# EAGLE design TFTBackpack (EAGLE 7.6.0)
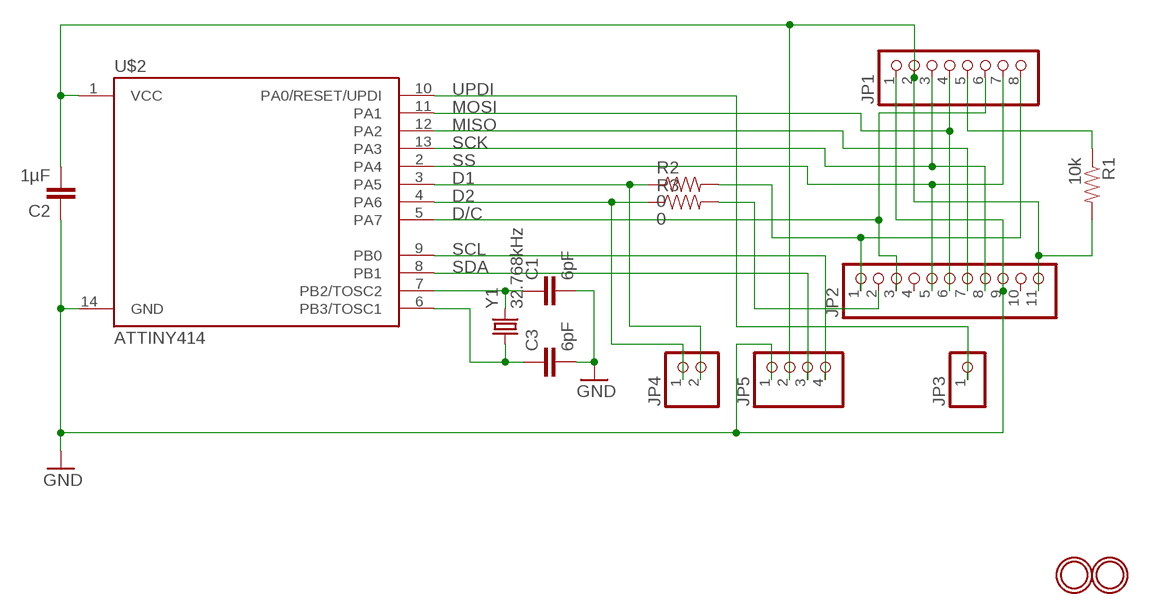
[diagram p0: schematic, sheet 1]

## Parts
C1  6pF  CAP0805  [0805]
C2  1µF  CAP0805  [0805]
C3  6pF  CAP0805  [0805]
JP1  HEADER-1X8ROUND  [1X08_ROUND]
JP2  HEADER-1X11  [1X11_ROUND]
JP3  HEADER-1X1ROUND  [1X01_ROUND]
JP4  HEADER-1X2ROUND  [1X02_ROUND]
JP5  HEADER-1X4ROUND  [1X04_ROUND]
R1  10k  0.3OHM-1/8W-1%(0805)  [0805]
R2  0  0.3OHM-1/8W-1%(0805)  [0805]
R3  0  0.3OHM-1/8W-1%(0805)  [0805]
U$1  MOUNTINGHOLE2.5  [MOUNTINGHOLE_2.5_PLATED]
U$2  ATTINY414  [SO14]
U$9  MOUNTINGHOLE2.5  [MOUNTINGHOLE_2.5_PLATED]
Y1  32.768kHz  CRYSTAL3.2X1.5MM  [CRYSTAL-SMD-3.2X1.5MM]

## Nets
BL: JP1.8 JP2.1 R2.2
D1: JP4.2 R2.1 U$2.3(PA5)
D2: JP4.1 R3.1 U$2.4(PA6)
D/C: JP1.6 JP2.3 U$2.5(PA7)
GND: C1.2 C2.1 C3.2 JP1.1 JP2.9 JP5.1 U$2.14(GND)
MISO: JP2.7 U$2.12(PA2)
MOSI: JP1.4 JP2.6 U$2.11(PA1)
N$2: C1.1 U$2.7(PB2/TOSC2) Y1.P$2
N$3: C3.1 U$2.6(PB3/TOSC1) Y1.P$1
N$4: JP1.5 R1.1
N$5: JP2.2 R3.2
SCK: JP1.3 JP2.8 U$2.13(PA3)
SCL: JP5.4 U$2.9(PB0)
SDA: JP5.3 U$2.8(PB1)
SS: JP1.7 JP2.5 U$2.2(PA4)
UPDI: JP3.1 U$2.10(PA0/RESET/UPDI)
VCC: C2.2 JP1.2 JP2.11 JP5.2 R1.2 U$2.1(VCC)
Unconnected: JP2.4 JP2.10

## Library data of the parts
C1-C3 = SparkFun-Capacitors:CAP: Capacitor Standard 0603 ceramic capacitor, and 0.1" leaded capacitor.
JP1 = technoblogy:HEADER-1X8: PIN HEADER
JP2 = technoblogy:HEADER-1X11
JP3 = microbuilder:HEADER-1X1: PIN HEADER
JP4 = microbuilder:HEADER-1X2: PIN HEADER
JP5 = microbuilder:HEADER-1X4: PIN HEADER
R1-R3 = SparkFun-Resistors:0.3OHM-1/8W-1%(0805): RES-11622; PROD_ID: RES-11622; VALUE: 0.3
U$1 U$9 = microbuilder:MOUNTINGHOLE: Mounting Hole For #2 screws (0.086"/2.18mm width, 0.094"/2.4mm hole) use 2.5mm; BOM: EXCLUDE
U$2 = technoblogy:ATTINY414: Atmel 14-pin 2/4/8kB flash uC; PROD_ID: IC-11285
Y1 = SparkFun-FreqCtrl:CRYSTAL: Various standard crystals. Proven footprints.; PROD_ID: XTAL-13062

## Net classes
1 power: width 0.305 mm

## Board
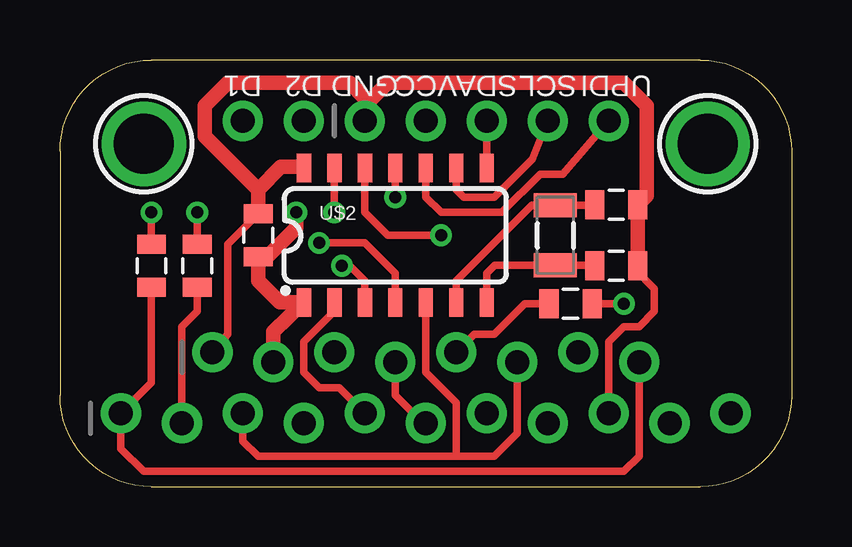
[diagram p1: board, top side]
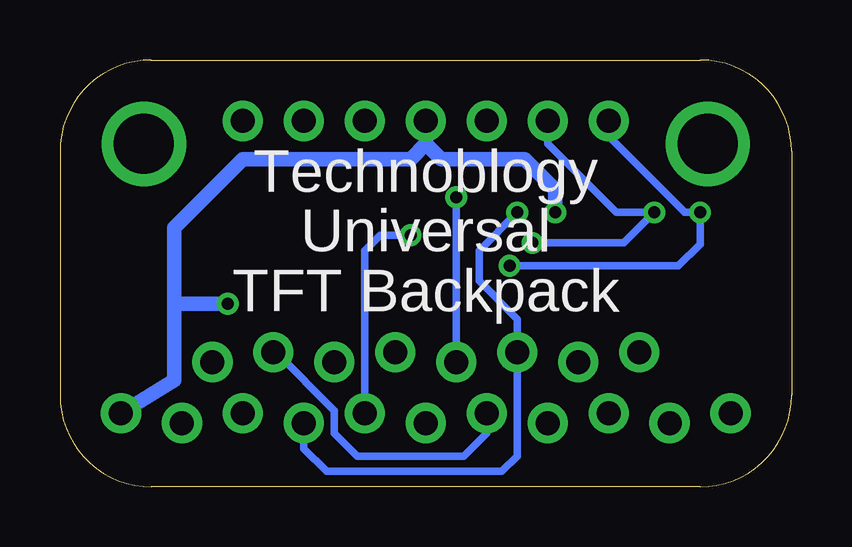
[diagram p2: board, bottom side, seen from below]

Size 30.48 x 17.78 mm. Coordinates in mm from the lower left corner, seen from the top.
Outline: 0,13.97 arc-90 3.81,17.78 26.67,17.78 arc-90 30.48,13.97 30.48,3.81 arc-90 26.67,0 3.81,0 arc-90 0,3.81 0,13.97
Copper layers (1*16): Top 0.035mm / dielectric 1.5mm / Bottom 0.035mm
Design rules "default *": minimum track width 10mil, minimum drill 24mil, track to track 8mil, track to pad 8mil, pad to pad 8mil, via to via 8mil, smd to smd 8mil, copper to edge 40mil, drill to drill 8mil, minimum pad ring 10mil, minimum via ring 8mil, stop-mask expansion 4mil, vias tented up to drill 20mil, thermal gap 10mil

### Footprints (pad centres in the part's own frame; a part is rotated, then mirrored left to right if it is on the bottom)
0805 = smd 0.8 x 1.2: 1 -0.9,0; 2 0.9,0
1X08_ROUND = drill 1 pad 1.676: 1 -8.89,0.203; 2 -6.35,-0.203; 3 -3.81,0.203; 4 -1.27,-0.203; 5 1.27,0.203; 6 3.81,-0.203; 7 6.35,0.203; 8 8.89,-0.203
1X11_ROUND = drill 1 pad 1.676: 1 -12.7,0.203; 2 -10.16,-0.203; 3 -7.62,0.203; 4 -5.08,-0.203; 5 -2.54,0.203; 6 0,-0.203; 7 2.54,0.203; 8 5.08,-0.203; 9 7.62,0.203; 10 10.16,-0.203; 11 12.7,0.203
1X01_ROUND = drill 1 pad 1.676: 1 0,0
1X02_ROUND = drill 1 pad 1.676: 1 -1.27,0; 2 1.27,0
1X04_ROUND = drill 1 pad 1.676: 1 -3.81,0; 2 -1.27,0; 3 1.27,0; 4 3.81,0
MOUNTINGHOLE_2.5_PLATED = drill 2.5 pad 3.2: P$1 0,0
SO14 = smd 0.6 x 1.2: 1 -3.81,-2.8; 2 -2.54,-2.8; 3 -1.27,-2.8; 4 0,-2.8; 5 1.27,-2.8; 6 2.54,-2.8; 7 3.81,-2.8; 8 3.81,2.8; 9 2.54,2.8; 10 1.27,2.8; 11 0,2.8; 12 -1.27,2.8; 13 -2.54,2.8; 14 -3.81,2.8
CRYSTAL-SMD-3.2X1.5MM = smd 1 x 1.8: P$1 -1.25,0; P$2 1.25,0

### Placement (x,y rotation side)
C1  23.18,9.21 0 top
C2  8.26,10.48 270 top
C3  23.18,11.75 0 top
JP1  15.24,5.4 0 top
JP2  15.24,2.86 0 top
JP3  22.86,15.24 0 top
JP4  8.89,15.24 180 top
JP5  16.51,15.24 0 top
R1  21.27,7.62 0 top
R2  3.81,9.21 270 top
R3  5.71,9.21 270 top
U$1  3.49,14.29 0 top
U$2  13.97,10.48 0 top
U$9  26.99,14.29 0 top
Y1  20.64,10.48 270 top

### Tracks (layer width: path | path; a pad name or v marks a point on that pad's centre or on a via)
BL
  Top 0.305: JP1.8 24.13,1.27 23.49,0.64 3.49,0.64 2.54,1.59 JP2.1 3.81,4.33 R2.2
D1  (via drill 0.5)
  Top 0.305: R2.1 v3.81,11.43 | v11.75,9.21 12.06,9.21 12.7,8.57 U$2.3
  Bottom 0.305: v11.75,9.21 4.71,9.21 R2.1 v3.81,11.43 4.45,11.43 7.62,14.61 JP4.2
D2  (via drill 0.5)
  Top 0.305: 13.97,7.3 U$2.4 13.97,8.89 12.7,10.16 v10.79,10.16 | v5.71,11.43 R3.1
  Bottom 0.305: v10.79,10.16 6.98,10.16 v5.71,11.43 7.3,11.43 10.16,14.29 JP4.1
D/C
  Top 0.305: 16.51,1.27 18.1,1.27 19.05,2.22 JP1.6 19.05,5.4 | 16.51,1.27 8.26,1.27 7.62,1.91 JP2.3 | 16.51,1.27 16.51,3.49 15.24,4.76 U$2.5
GND
  Top 0.305: JP1.1 6.98,6.35 6.98,10.11 C2.1 | JP2.9 22.86,6.03 23.49,6.67 24.13,6.67 24.77,7.3 24.77,8.26 24.4,8.62 C1.2
  Top 0.61: C1.2 C3.2 24.45,12.12 24.45,15.88 23.49,16.83 13.65,16.83 12.7,15.88 JP5.1 12.7,16.19 12.06,16.83 6.98,16.83 6.03,15.88 6.03,14.61 8.26,12.38 | C2.1 8.26,12.38 | 8.26,12.38 9.21,13.34 10.1,13.34 U$2.14
MISO  (via drill 0.5)
  Top 0.305: U$2.12 12.7,11.43 13.65,10.48 v15.87,10.48
  Bottom 0.305: JP2.7 17.78,9.84 17.15,10.48 v15.87,10.48
MOSI  (via drill 0.5)
  Top 0.305: JP2.6 15.13,2.65 13.97,3.81 JP1.4 | U$2.11 v13.97,12.06
  Bottom 0.305: JP1.4 v13.97,12.06
N$2
  Top 0.305: U$2.7 17.78,8.89 18.12,9.23 Y1.P$2 22.28,9.23 C1.1
N$3
  Top 0.305: U$2.6 16.51,8.57 19.66,11.73 Y1.P$1 22.28,11.73 C3.1
N$4
  Top 0.305: R1.1 19.37,7.62 18.1,6.35 17.26,6.35 JP1.5
N$5
  Top 0.305: 5.19,2.65 JP2.2 5.08,6.67 5.71,7.3 R3.2
SCK  (via drill 0.5)
  Top 0.305: 11.43,13.65 U$2.13 v11.43,11.43
  Bottom 0.305: JP2.8 20.32,1.59 19.37,0.64 12.06,0.64 11.43,1.27 JP1.3 11.43,6.99 13.02,8.57 13.02,9.84 v11.43,11.43
SCL
  Top 0.305: U$2.9 16.51,12.38 16.83,12.06 18.1,12.06 19.69,13.65 JP5.4
SDA
  Top 0.305: U$2.8 JP5.3
SS
  Top 0.305: U$2.2 11.43,7.3 10.16,6.03 10.16,4.76 10.79,4.13 11.63,4.13 JP2.5
  Bottom 0.305: JP2.5 12.7,2.22 13.65,1.27 18.1,1.27 19.05,2.22 19.05,3.17 21.48,5.6 JP1.7
UPDI
  Top 0.305: U$2.10 15.24,12.06 15.87,11.43 18.41,11.43 20,13.02 20.95,13.02 JP3.1
VCC  (via drill 0.5)
  Top 0.305: R1.2 v23.49,7.62 | C2.2 8.62,9.58
  Top 0.61: JP1.2 8.89,6.46 U$2.1 9.15,7.68 8.26,8.57 C2.2 | 8.62,9.58 9.84,10.79 v9.84,11.43
  Bottom 0.61: JP2.11 25.72,4.45 25.72,7.62 | v23.49,7.62 25.72,7.62 | JP5.2 15.24,14.29 | 15.24,14.29 15.87,13.65 22.86,13.65 25.72,10.79 25.72,7.62 | v9.84,11.43 9.84,12.38 11.11,13.65 14.6,13.65 15.24,14.29

### Text on the board
tPlace: D1 | D2 | GND | VCC | SDA | SCL | UPDI
bPlace: Technoblogy / Universal / TFT Backpack